# EAGLE schematic HiFi Audio (EAGLE 7.1.0)
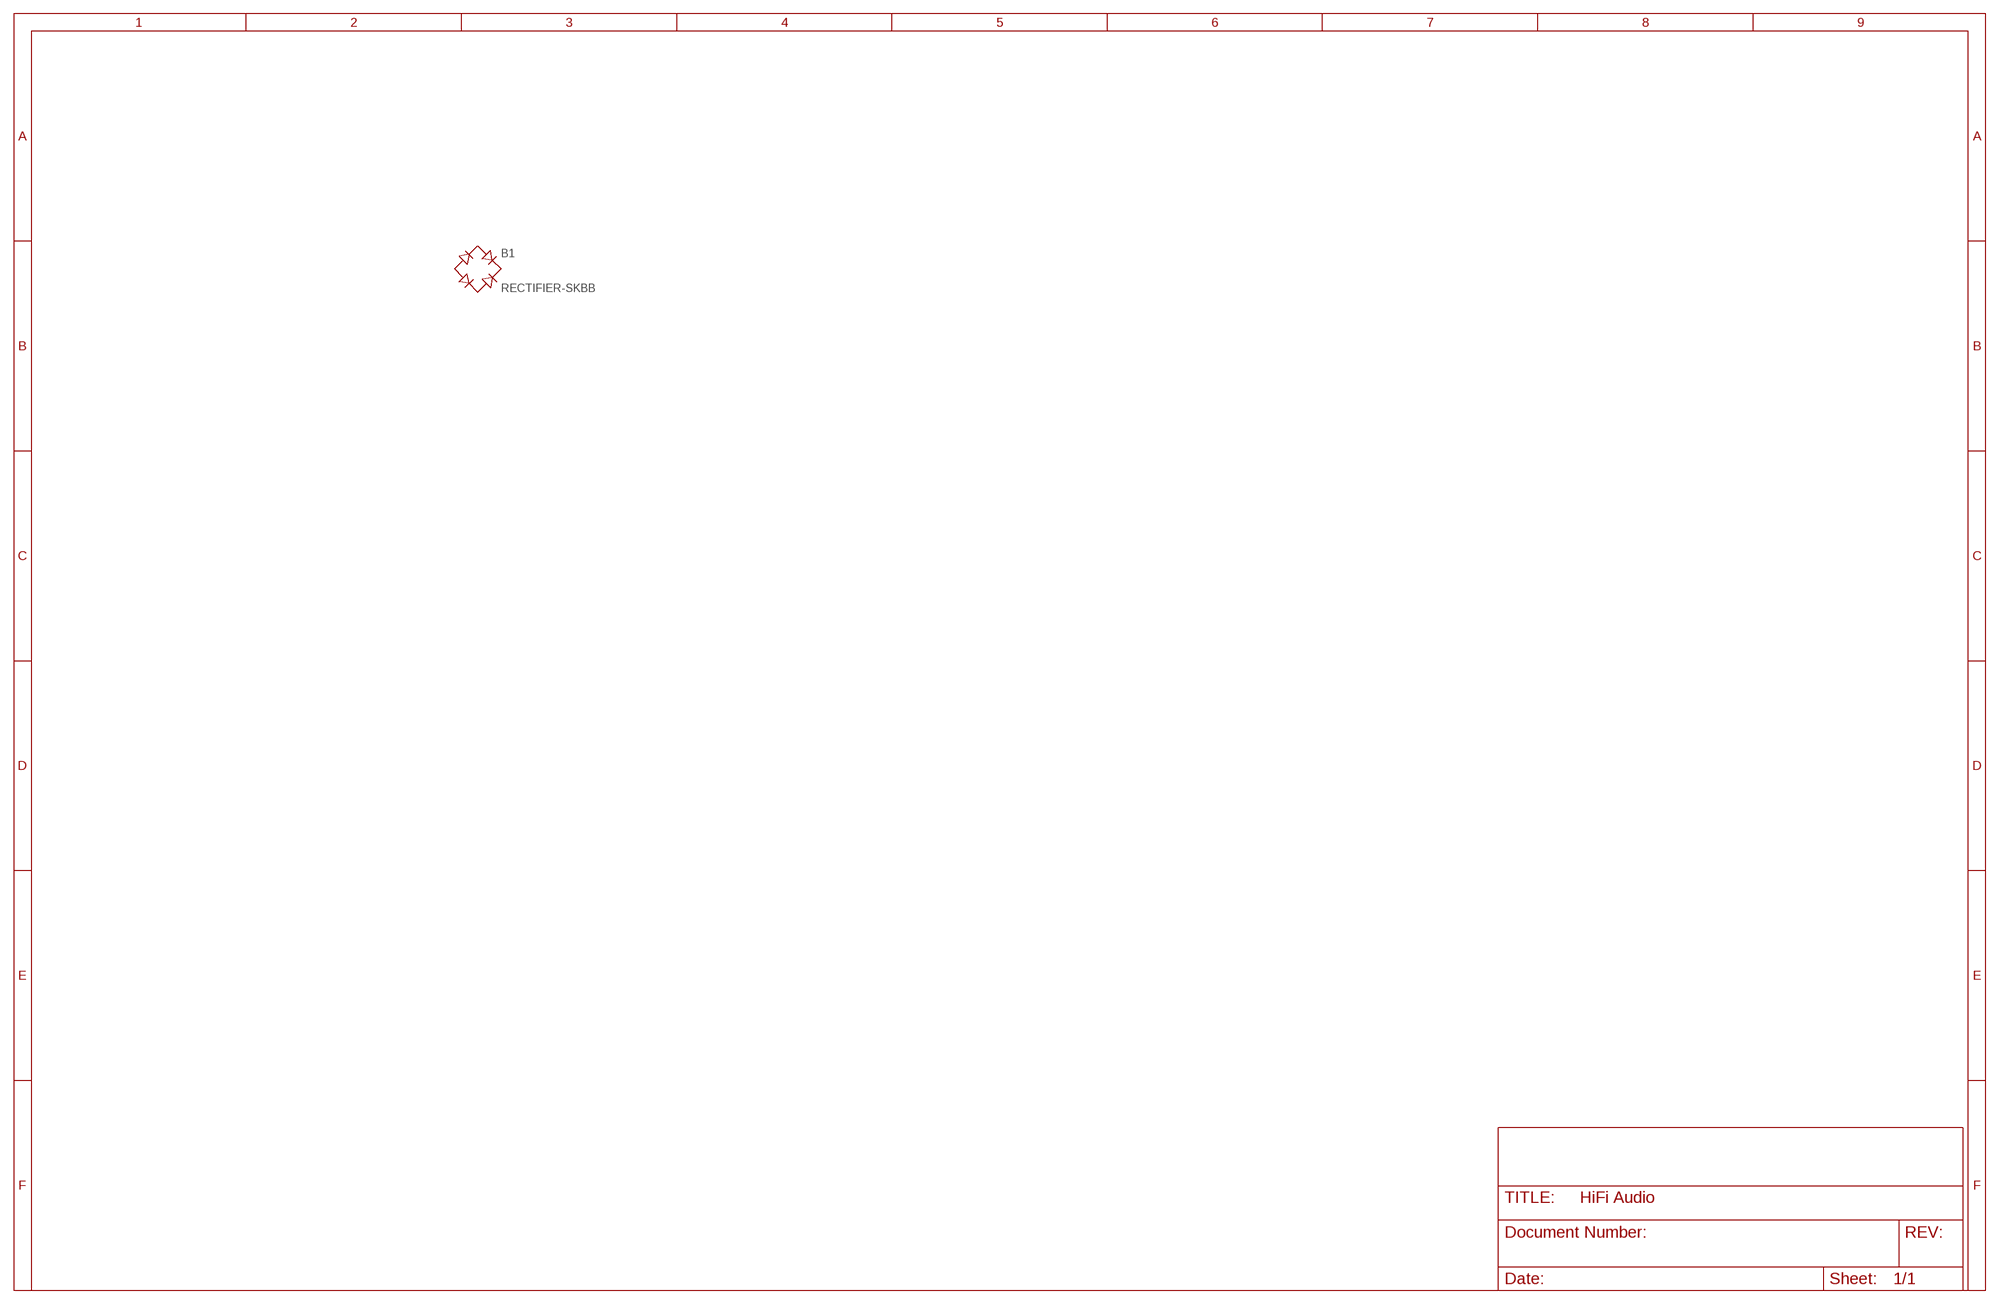
[diagram p0: schematic, sheet 1]

## Parts
B1  RECTIFIER-SKBB  [SKBB]
Unconnected: B1.+ B1.- B1.AC1 B1.AC2

## Library data of the parts
B1 = rectifier:RECTIFIER-: Rectifier